# Altium schematic sheet 3V3 voltage regulato.SchDoc
size A4
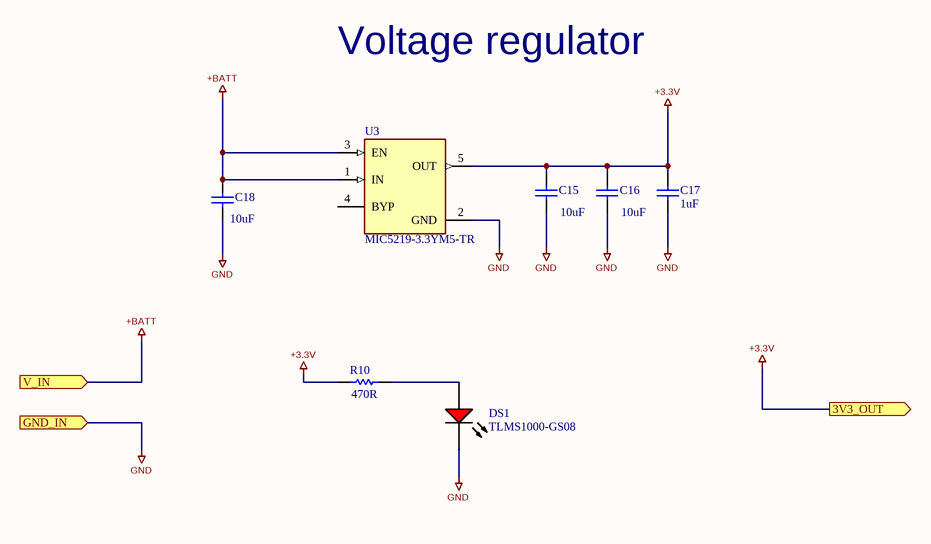
[diagram p0: 3V3 voltage regulato.SchDoc]

## Parts
C15  10uF  [CAPC1608X90X35NL10T15]
C16  10uF  [CAPC1608X90X35NL10T15]
C17  1uF  [CAPC1608X90X35LL10T15]
C18  10uF  [CAPC1608X90X35NL10T15]
DS1  TLMS1000-GS08  [VISH-TLMS1000_V]
R10  470R  [RESC1608X55X25LL10T15]
U3  MIC5219-3.3YM5-TR  [FP-SOT23-5LD-PL-1-IPC_C]

## Ports
3V3_OUT (out), GND_IN (in), V_IN (in)

## Nets
+3.3V: C15.2 C16.2 C17.2 R10.1 U3.5(OUT) ; port 3V3_OUT
+BATT: C18.2 U3.1(IN) U3.3(EN) ; port V_IN
GND: C15.1 C16.1 C17.1 C18.1 DS1.2(K) U3.2(GND) ; port GND_IN
NetDS1_1: DS1.1(A) R10.2

Not connected (* = marked no-connect by the designer): U3 4(BYP)

## Notes on the sheet
- Voltage regulator

## Library data of the parts
C15 C16 C18 = CMP-2006-02792-1: Part Number: GRM188R60J106ME47D; Manufacturer: Murata
C17 = CMP-2006-02459-1: Manufacturer: Murata; Part Number: GRM188R61E105KA12D
DS1 = CMP-2000-07254-1: Low Current LED, 40 mW, 1.8 V, -40 to 100 degC, 2-Pin SMD (0603), RoHS, Tape and Reel; Manufacturer: Vishay; Lens Shape: Rectangular; Automotive Qualification Standard: AEC-Q100; Wavelength Typ: 636nm; SVHC: ToBeAdvised; LED Colour: Red; Bulb Size: 1.6mmx0.8mm; Forward Voltage: 1.8V; Luminous Intensity: 4mcd; Forward Current If: 2mA; Viewing Angle: 80°; Datasheet Version: Rev. 1.7, 02/2011; Datasheet URL: https://datasheet.ciiva.com/5798/1698881-5798337.pdf; LED Mounting: SMD; Packaging: CutTape; Package Reference: TLMS1000; Manufacturer URL: http://www.vishay.com/; Mounting Technology: SurfaceMount; Product Range: -; Package Description: 2-Pin Surface Mount Device, Body 1.6 x 0.8 mm; MSL: MSL2-1year
R10 = CMP-1659-00035-1: General Purpose Chip Resistor, 470 Ohm, +/- 1%, -55 to 155 degC, 0603 (1608 Metric), RoHS, Tape and Reel; Impedance: 50 Ohm; Fastening Type: Snap; Min Operating Temperature: -40 degC; Length: 3 mm; PackageReference: 0603; Contact Material: Brass; Max Operating Temperature: 90 degC; ComponentLink2URL: https://datasheet.ciiva.com/11808/0900766b80f96399-11808177.pdf; Packaging: Tape and Reel; DatasheetVersion: Rev. 4, 04/2009; Contact Plating: Gold; Radiation Hardening: No; Height: 1.25 mm; Resistance: 50 Ohm; RoHSCompliant: true; ComponentLink2Description: Datasheet; Package Quantity: 2500; ComponentLink1URL: http://www.yageo.com/; Width: 3.1 mm; Mount: Surface Mount; PackageDescription: 2-Pin Surface Mount Device, Body 1.6 x 0.8 mm; ComponentLink1Description: Manufacturer URL
U3 = CMP-06324-000027-1: IC REG LINEAR 3.3V 500MA SOT23-5; Dropout Voltage: 350mV; Output Type: Fixed; Number of Regulators: 1; Max Input Voltage: 12V; Min Input Voltage: 2.5V; Min Operating Temperature: -40°C; Nominal Output Voltage: 3.3V; Output Voltage: 3.3V; Packaging: Cut Tape; Mount: Surface Mount; Number of Pins: 5; Case/Package: SOT-23-5; Lead Free: Lead Free; Max Operating Temperature: 125°C; REACH SVHC: No SVHC; Output Current: 500mA